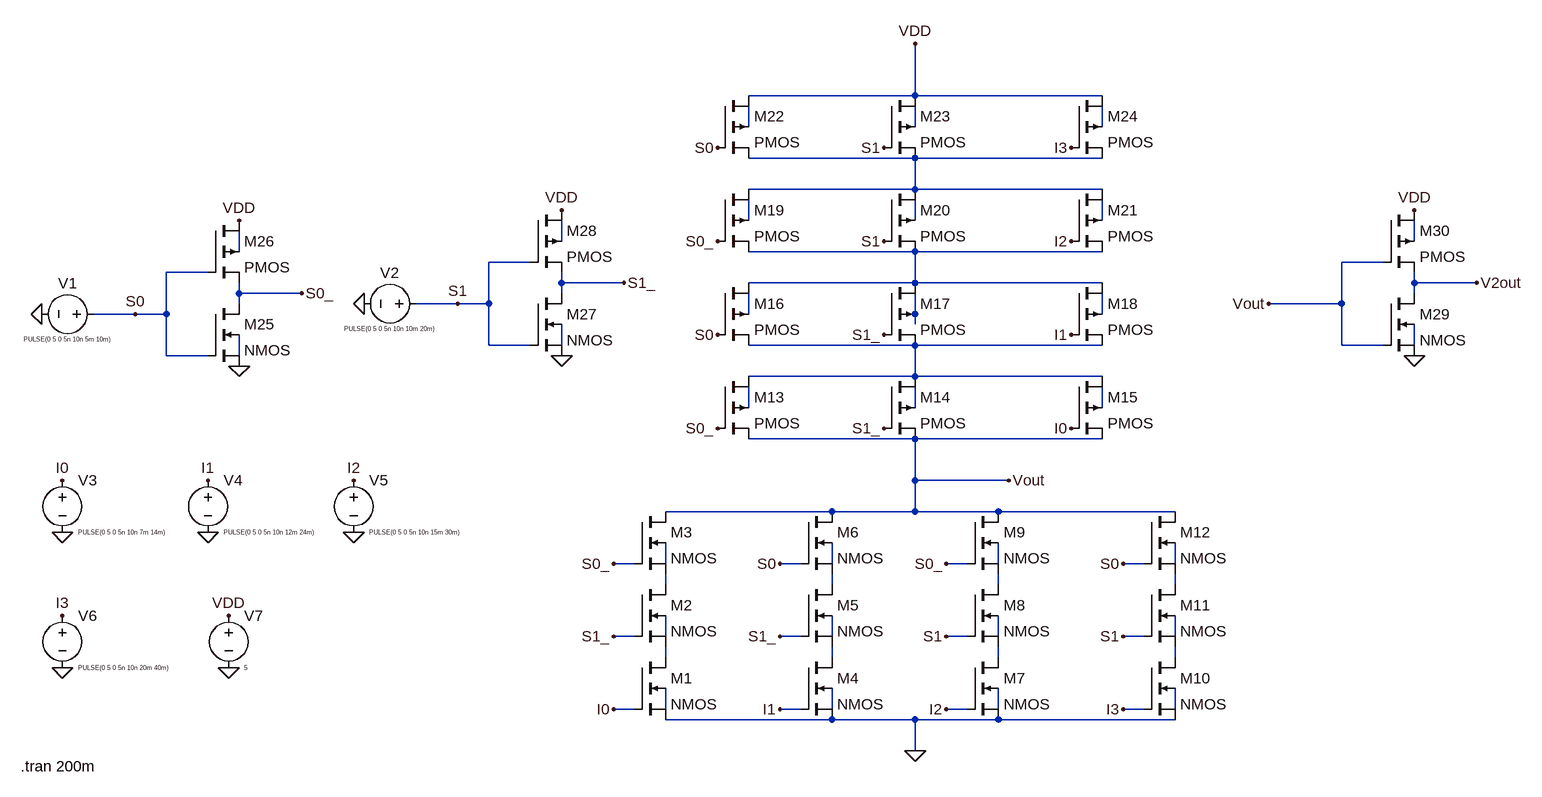
[diagram p0: schematic CMOS_MUX.asc]
CMOS_MUX.asc, the LTspice schematic file:
Version 4
SHEET 1 1364 680
WIRE 416 -640 416 -720
WIRE 416 -640 160 -640
WIRE 704 -640 416 -640
WIRE 160 -592 160 -624
WIRE 416 -592 416 -624
WIRE 704 -592 704 -624
WIRE 416 -544 160 -544
WIRE 704 -544 416 -544
WIRE 416 -496 416 -544
WIRE 416 -496 160 -496
WIRE 704 -496 416 -496
WIRE 160 -448 160 -480
WIRE 416 -448 416 -480
WIRE 704 -448 704 -480
WIRE -128 -416 -128 -448
WIRE 1184 -416 1184 -448
WIRE -624 -400 -624 -432
WIRE 416 -400 160 -400
WIRE 704 -400 416 -400
WIRE -176 -384 -240 -384
WIRE 1136 -384 1072 -384
WIRE -672 -368 -736 -368
WIRE -128 -352 -128 -368
WIRE -32 -352 -128 -352
WIRE 416 -352 416 -400
WIRE 416 -352 160 -352
WIRE 704 -352 416 -352
WIRE 1184 -352 1184 -368
WIRE 1280 -352 1184 -352
WIRE -624 -336 -624 -352
WIRE -528 -336 -624 -336
WIRE -128 -336 -128 -352
WIRE 1184 -336 1184 -352
WIRE -624 -320 -624 -336
WIRE -288 -320 -352 -320
WIRE -240 -320 -240 -384
WIRE -240 -320 -288 -320
WIRE 1072 -320 1072 -384
WIRE 1072 -320 960 -320
WIRE -784 -304 -848 -304
WIRE -736 -304 -736 -368
WIRE -736 -304 -784 -304
WIRE 160 -304 160 -336
WIRE 416 -304 416 -336
WIRE 704 -304 704 -336
WIRE 416 -288 416 -304
WIRE -240 -256 -240 -320
WIRE -176 -256 -240 -256
WIRE -128 -256 -128 -288
WIRE 416 -256 160 -256
WIRE 704 -256 416 -256
WIRE 1072 -256 1072 -320
WIRE 1136 -256 1072 -256
WIRE 1184 -256 1184 -288
WIRE -736 -240 -736 -304
WIRE -672 -240 -736 -240
WIRE -624 -240 -624 -272
WIRE 416 -208 416 -256
WIRE 416 -208 160 -208
WIRE 704 -208 416 -208
WIRE 160 -160 160 -192
WIRE 416 -160 416 -192
WIRE 704 -160 704 -192
WIRE 416 -112 160 -112
WIRE 704 -112 416 -112
WIRE 416 -48 416 -112
WIRE 560 -48 416 -48
WIRE 288 0 32 0
WIRE 416 0 416 -48
WIRE 416 0 288 0
WIRE 544 0 416 0
WIRE 816 0 544 0
WIRE -16 80 -48 80
WIRE 32 80 32 48
WIRE 240 80 208 80
WIRE 288 80 288 48
WIRE 496 80 464 80
WIRE 544 80 544 48
WIRE 768 80 736 80
WIRE 816 80 816 48
WIRE 32 112 32 96
WIRE 288 112 288 96
WIRE 544 112 544 96
WIRE 816 112 816 96
WIRE -16 192 -48 192
WIRE 32 192 32 160
WIRE 240 192 208 192
WIRE 288 192 288 160
WIRE 496 192 464 192
WIRE 544 192 544 160
WIRE 768 192 736 192
WIRE 816 192 816 160
WIRE 32 224 32 208
WIRE 288 224 288 208
WIRE 544 224 544 208
WIRE 816 224 816 208
WIRE -16 304 -48 304
WIRE 32 304 32 272
WIRE 240 304 208 304
WIRE 288 304 288 272
WIRE 496 304 464 304
WIRE 544 304 544 272
WIRE 768 304 736 304
WIRE 816 304 816 272
WIRE 288 320 32 320
WIRE 416 320 288 320
WIRE 544 320 416 320
WIRE 816 320 544 320
WIRE 416 368 416 320
FLAG -48 80 S0_
FLAG -48 192 S1_
FLAG -48 304 I0
FLAG 208 80 S0
FLAG 208 192 S1_
FLAG 208 304 I1
FLAG 464 80 S0_
FLAG 464 192 S1
FLAG 464 304 I2
FLAG 736 80 S0
FLAG 736 192 S1
FLAG 736 304 I3
FLAG 112 -128 S0_
FLAG 368 -128 S1_
FLAG 656 -128 I0
FLAG 112 -272 S0
FLAG 368 -272 S1_
FLAG 656 -272 I1
FLAG 112 -416 S0_
FLAG 368 -416 S1
FLAG 656 -416 I2
FLAG 112 -560 S0
FLAG 368 -560 S1
FLAG 656 -560 I3
FLAG 416 -720 VDD
FLAG 416 368 0
FLAG 560 -48 Vout
FLAG -528 -336 S0_
FLAG -784 -304 S0
FLAG -624 -448 VDD
FLAG -624 -224 0
FLAG -928 -304 0
FLAG -32 -352 S1_
FLAG -288 -320 S1
FLAG -128 -464 VDD
FLAG -128 -240 0
FLAG -432 -320 0
FLAG -896 32 0
FLAG -896 -48 I0
FLAG -672 32 0
FLAG -672 -48 I1
FLAG -448 32 0
FLAG -448 -48 I2
FLAG -896 240 0
FLAG -896 160 I3
FLAG -640 240 0
FLAG -640 160 VDD
FLAG 1280 -352 V2out
FLAG 1184 -464 VDD
FLAG 1184 -240 0
FLAG 960 -320 Vout
SYMBOL nmos4 -16 224 R0
SYMATTR InstName M1
SYMBOL nmos4 -16 112 R0
SYMATTR InstName M2
SYMBOL nmos4 -16 0 R0
SYMATTR InstName M3
SYMBOL nmos4 240 224 R0
SYMATTR InstName M4
SYMBOL nmos4 240 112 R0
SYMATTR InstName M5
SYMBOL nmos4 240 0 R0
SYMATTR InstName M6
SYMBOL nmos4 496 224 R0
SYMATTR InstName M7
SYMBOL nmos4 496 112 R0
SYMATTR InstName M8
SYMBOL nmos4 496 0 R0
SYMATTR InstName M9
SYMBOL nmos4 768 224 R0
SYMATTR InstName M10
SYMBOL nmos4 768 112 R0
SYMATTR InstName M11
SYMBOL nmos4 768 0 R0
SYMATTR InstName M12
SYMBOL pmos4 112 -208 R0
SYMATTR InstName M13
SYMBOL pmos4 368 -208 R0
SYMATTR InstName M14
SYMBOL pmos4 656 -208 R0
SYMATTR InstName M15
SYMBOL pmos4 112 -352 R0
SYMATTR InstName M16
SYMBOL pmos4 368 -352 R0
SYMATTR InstName M17
SYMBOL pmos4 656 -352 R0
SYMATTR InstName M18
SYMBOL pmos4 112 -496 R0
SYMATTR InstName M19
SYMBOL pmos4 368 -496 R0
SYMATTR InstName M20
SYMBOL pmos4 656 -496 R0
SYMATTR InstName M21
SYMBOL pmos4 112 -640 R0
SYMATTR InstName M22
SYMBOL pmos4 368 -640 R0
SYMATTR InstName M23
SYMBOL pmos4 656 -640 R0
SYMATTR InstName M24
SYMBOL nmos4 -672 -320 R0
SYMATTR InstName M25
SYMBOL pmos4 -672 -448 R0
SYMATTR InstName M26
SYMBOL voltage -832 -304 R90
WINDOW 0 -32 56 VBottom 2
WINDOW 3 32 56 VTop 0
WINDOW 123 0 0 Left 0
WINDOW 39 0 0 Left 0
SYMATTR InstName V1
SYMATTR Value PULSE(0 5 0 5n 10n 5m 10m)
SYMBOL nmos4 -176 -336 R0
SYMATTR InstName M27
SYMBOL pmos4 -176 -464 R0
SYMATTR InstName M28
SYMBOL voltage -336 -320 R90
WINDOW 0 -32 56 VBottom 2
WINDOW 3 32 56 VTop 0
WINDOW 123 0 0 Left 0
WINDOW 39 0 0 Left 0
SYMATTR InstName V2
SYMATTR Value PULSE(0 5 0 5n 10n 10m 20m)
SYMBOL voltage -896 -64 R0
WINDOW 3 24 96 Left 0
WINDOW 123 0 0 Left 0
WINDOW 39 0 0 Left 0
SYMATTR InstName V3
SYMATTR Value PULSE(0 5 0 5n 10n 7m 14m)
SYMBOL voltage -672 -64 R0
WINDOW 3 24 96 Left 0
WINDOW 123 0 0 Left 0
WINDOW 39 0 0 Left 0
SYMATTR InstName V4
SYMATTR Value PULSE(0 5 0 5n 10n 12m 24m)
SYMBOL voltage -448 -64 R0
WINDOW 3 24 96 Left 0
WINDOW 123 0 0 Left 0
WINDOW 39 0 0 Left 0
SYMATTR InstName V5
SYMATTR Value PULSE(0 5 0 5n 10n 15m 30m)
SYMBOL voltage -896 144 R0
WINDOW 3 24 96 Left 0
WINDOW 123 0 0 Left 0
WINDOW 39 0 0 Left 0
SYMATTR InstName V6
SYMATTR Value PULSE(0 5 0 5n 10n 20m 40m)
SYMBOL voltage -640 144 R0
WINDOW 3 24 96 Left 0
WINDOW 123 0 0 Left 0
WINDOW 39 0 0 Left 0
SYMATTR InstName V7
SYMATTR Value 5
SYMBOL nmos4 1136 -336 R0
SYMATTR InstName M29
SYMBOL pmos4 1136 -464 R0
SYMATTR InstName M30
TEXT -960 392 Left 2 !.tran 200m

The netlist it stands for:
* CMOS_MUX.asc
M1 N034 I0 0 N038 NMOS
M2 N026 S1_ N034 N030 NMOS
M3 Vout S0_ N026 N022 NMOS
M4 N035 I1 0 N039 NMOS
M5 N027 S1_ N035 N031 NMOS
M6 Vout S0 N027 N023 NMOS
M7 N036 I2 0 N040 NMOS
M8 N028 S1 N036 N032 NMOS
M9 Vout S0_ N028 N024 NMOS
M10 N037 I3 0 N041 NMOS
M11 N029 S1 N037 N033 NMOS
M12 Vout S0 N029 N025 NMOS
M13 N016 S0_ Vout N019 PMOS
M14 N016 S1_ Vout N020 PMOS
M15 N016 I0 Vout N021 PMOS
M16 N011 S0 N016 N012 PMOS
M17 N011 S1_ N016 N013 PMOS
M18 N011 I1 N016 N014 PMOS
M19 N004 S0_ N011 N005 PMOS
M20 N004 S1 N011 N006 PMOS
M21 N004 I2 N011 N007 PMOS
M22 VDD S0 N004 N001 PMOS
M23 VDD S1 N004 N002 PMOS
M24 VDD I3 N004 N003 PMOS
M25 S0_ S0 0 N018 NMOS
M26 VDD S0 S0_ N010 PMOS
V1 S0 0 PULSE(0 5 0 5n 10n 5m 10m)
M27 S1_ S1 0 N015 NMOS
M28 VDD S1 S1_ N008 PMOS
V2 S1 0 PULSE(0 5 0 5n 10n 10m 20m)
V3 I0 0 PULSE(0 5 0 5n 10n 7m 14m)
V4 I1 0 PULSE(0 5 0 5n 10n 12m 24m)
V5 I2 0 PULSE(0 5 0 5n 10n 15m 30m)
V6 I3 0 PULSE(0 5 0 5n 10n 20m 40m)
V7 VDD 0 5
M29 V2out Vout 0 N017 NMOS
M30 VDD Vout V2out N009 PMOS
.model NMOS NMOS
.model PMOS PMOS
.lib standard.mos
.tran 200m
.backanno
.end